# Altium schematic sheet Main Encoder.SchDoc: Encoder
size B; Engineer: Kyle Dick; Revision: 1; SheetNumber: 12; SheetTotal: 12
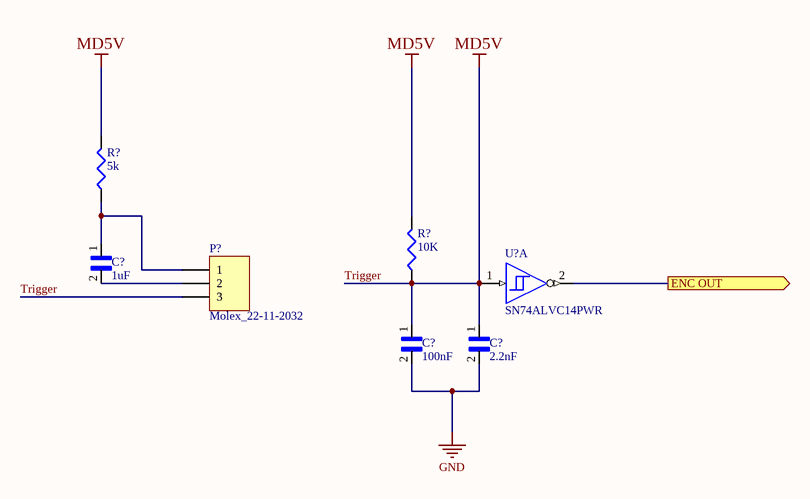
[diagram p0: Main Encoder.SchDoc]

## Parts
(Parts that share a designator on the sheet are numbered #1, #2 ... from top to bottom, then left to right.)
C?#1  1uF  [10 uF Cap]
C?#2  100nF  [10 uF Cap]
C?#3  2.2nF  [10 uF Cap]
P?  Molex_22-11-2032  [MOLEX_22-11-2032]
R?#1  5k  [RESC2112X05M]
R?#2  10K  [RESC2112X05M]
U?  SN74ALVC14PWR  [PW0014A_N]  (part A of 7)

## Ports
ENC OUT (out)

## Nets
GND: C?#2.2 C?#3.2
Trigger: C?#2.1 C?#3.1 P?.3 R?#1.2 R?#2.1 R?#2.2 U?.1(1A)  [also labelled MD5V]
ENC OUT: U?.2(~{1Y}) ; port ENC OUT
NetC?#1_1: C?#1.1 P?.1 R?#1.1
NetC?#1_2: C?#1.2 P?.2

## Notes on the sheet
- ESE
- is the sole property of ESE. Any reproduction
- The Information Contained in this drawing
- Schematic P/N and Name
- Sheet Name
- 850 Fountain St. S.
- Cambridge, ON N3H 0A8
- Canada
- Approved
- in part or in whole without the written
- permission of ESE is strictly prohibited.
- APPROVALS
- DATE
- Size
- Scale
- B
- NTS
- Bare PCB P/N
- Date
- Sheet
- Rev.
- Checked
- Created
- of

## Library data of the parts
C?#1 = Capacitor 1uF: Ceramic Capacitor 1210; MF: Samsung Electro-Mechanics; MP: CL32A106KBJNNNE; Check_prices: https://www.snapeda.com/parts/CL32A106KBJNNNE/Samsung%20Electro-Mechanics/view-part/3598300/?ref=eda; Value: *; SnapEDA_Link: https://www.snapeda.com/parts/CL32A106KBJNNNE/Samsung%20Electro-Mechanics/view-part/3598300/?ref=snap; Package: 1210 Samsung; Availability: Unavailable; Price: None; Supplier 1: Arrow Electronics; Supplier Part Number 1: CL32B105KCJNNNE
C?#2 = Capacitor 0.1uF: Ceramic Capacitor 1210; MF: Samsung Electro-Mechanics; MP: CL32A106KBJNNNE; Check_prices: https://www.snapeda.com/parts/CL32A106KBJNNNE/Samsung%20Electro-Mechanics/view-part/3598300/?ref=eda; Value: *; SnapEDA_Link: https://www.snapeda.com/parts/CL32A106KBJNNNE/Samsung%20Electro-Mechanics/view-part/3598300/?ref=snap; Package: 1210 Samsung; Availability: Unavailable; Price: None; Supplier 1: Mouser; Supplier Part Number 1: 80-C1210C104K1R
C?#3 = Capacitor 2.2nF: Ceramic Capacitor 1210; MF: Samsung Electro-Mechanics; MP: CL32A106KBJNNNE; Check_prices: https://www.snapeda.com/parts/CL32A106KBJNNNE/Samsung%20Electro-Mechanics/view-part/3598300/?ref=eda; Value: *; SnapEDA_Link: https://www.snapeda.com/parts/CL32A106KBJNNNE/Samsung%20Electro-Mechanics/view-part/3598300/?ref=snap; Package: 1210 Samsung; Availability: Unavailable; Price: None; Supplier 1: Mouser; Supplier Part Number 1: 80-C1210C222K1HAUTO
P? = Molex_22-11-2032: CONN HEADER 3POS .100 VERT GOLD; MPN: 0022112032; PN: WM2701-ND; URL: http://www.digikey.ca/product-detail/en/0022112032/WM2701-ND
R?#1 = Resistor 5k: 5k 1206 smd; Supplier: Arrow Electronics; Supplier Part Number: RMCF1206FT10K0; Supplier 1: Arrow Electronics; Supplier Part Number 1: RMCF1206FT10K0
R?#2 = Resistor 10k: 10k 1206 smd; Supplier: Arrow Electronics; Supplier Part Number: RMCF1206FT10K0; Supplier 1: Arrow Electronics; Supplier Part Number 1: RMCF1206FT10K0
U? = CMP-1615-01048-3: Hex Schmitt-Trigger Inverter, PW0014A, LARGE T&R; Manufacturer: Texas Instruments; Schmitt Trigger: Yes; Technology Family: ALVC; VCC(Min)(V): 2.3; Output Drive (IOL/IOH)(Max)(mA): -24/24; ICC @ Nom Voltage(Max)(mA): 0.01; Input Type: TTL; Output Type: CMOS; tpd @ Nom Voltage(Max)(ns): 3.7,3.9,3.4; VCC(Max)(V): 3.6; Bits(#): 6; F @ Nom Voltage(Max)(Mhz): 100; Rating: Catalog; Voltage(Nom)(V): 2.5,2.7,3.3; Code_JEDEC: MO-153; Operating Temperature Range(C): -40 to 85; DatasheetVersion: SCES107H; PackageReference: PW0014A; Generic Part Number: SN74ALVC14